# Altium schematic sheet 18 USB3_ports.SchDoc
size 420 x 297 mm
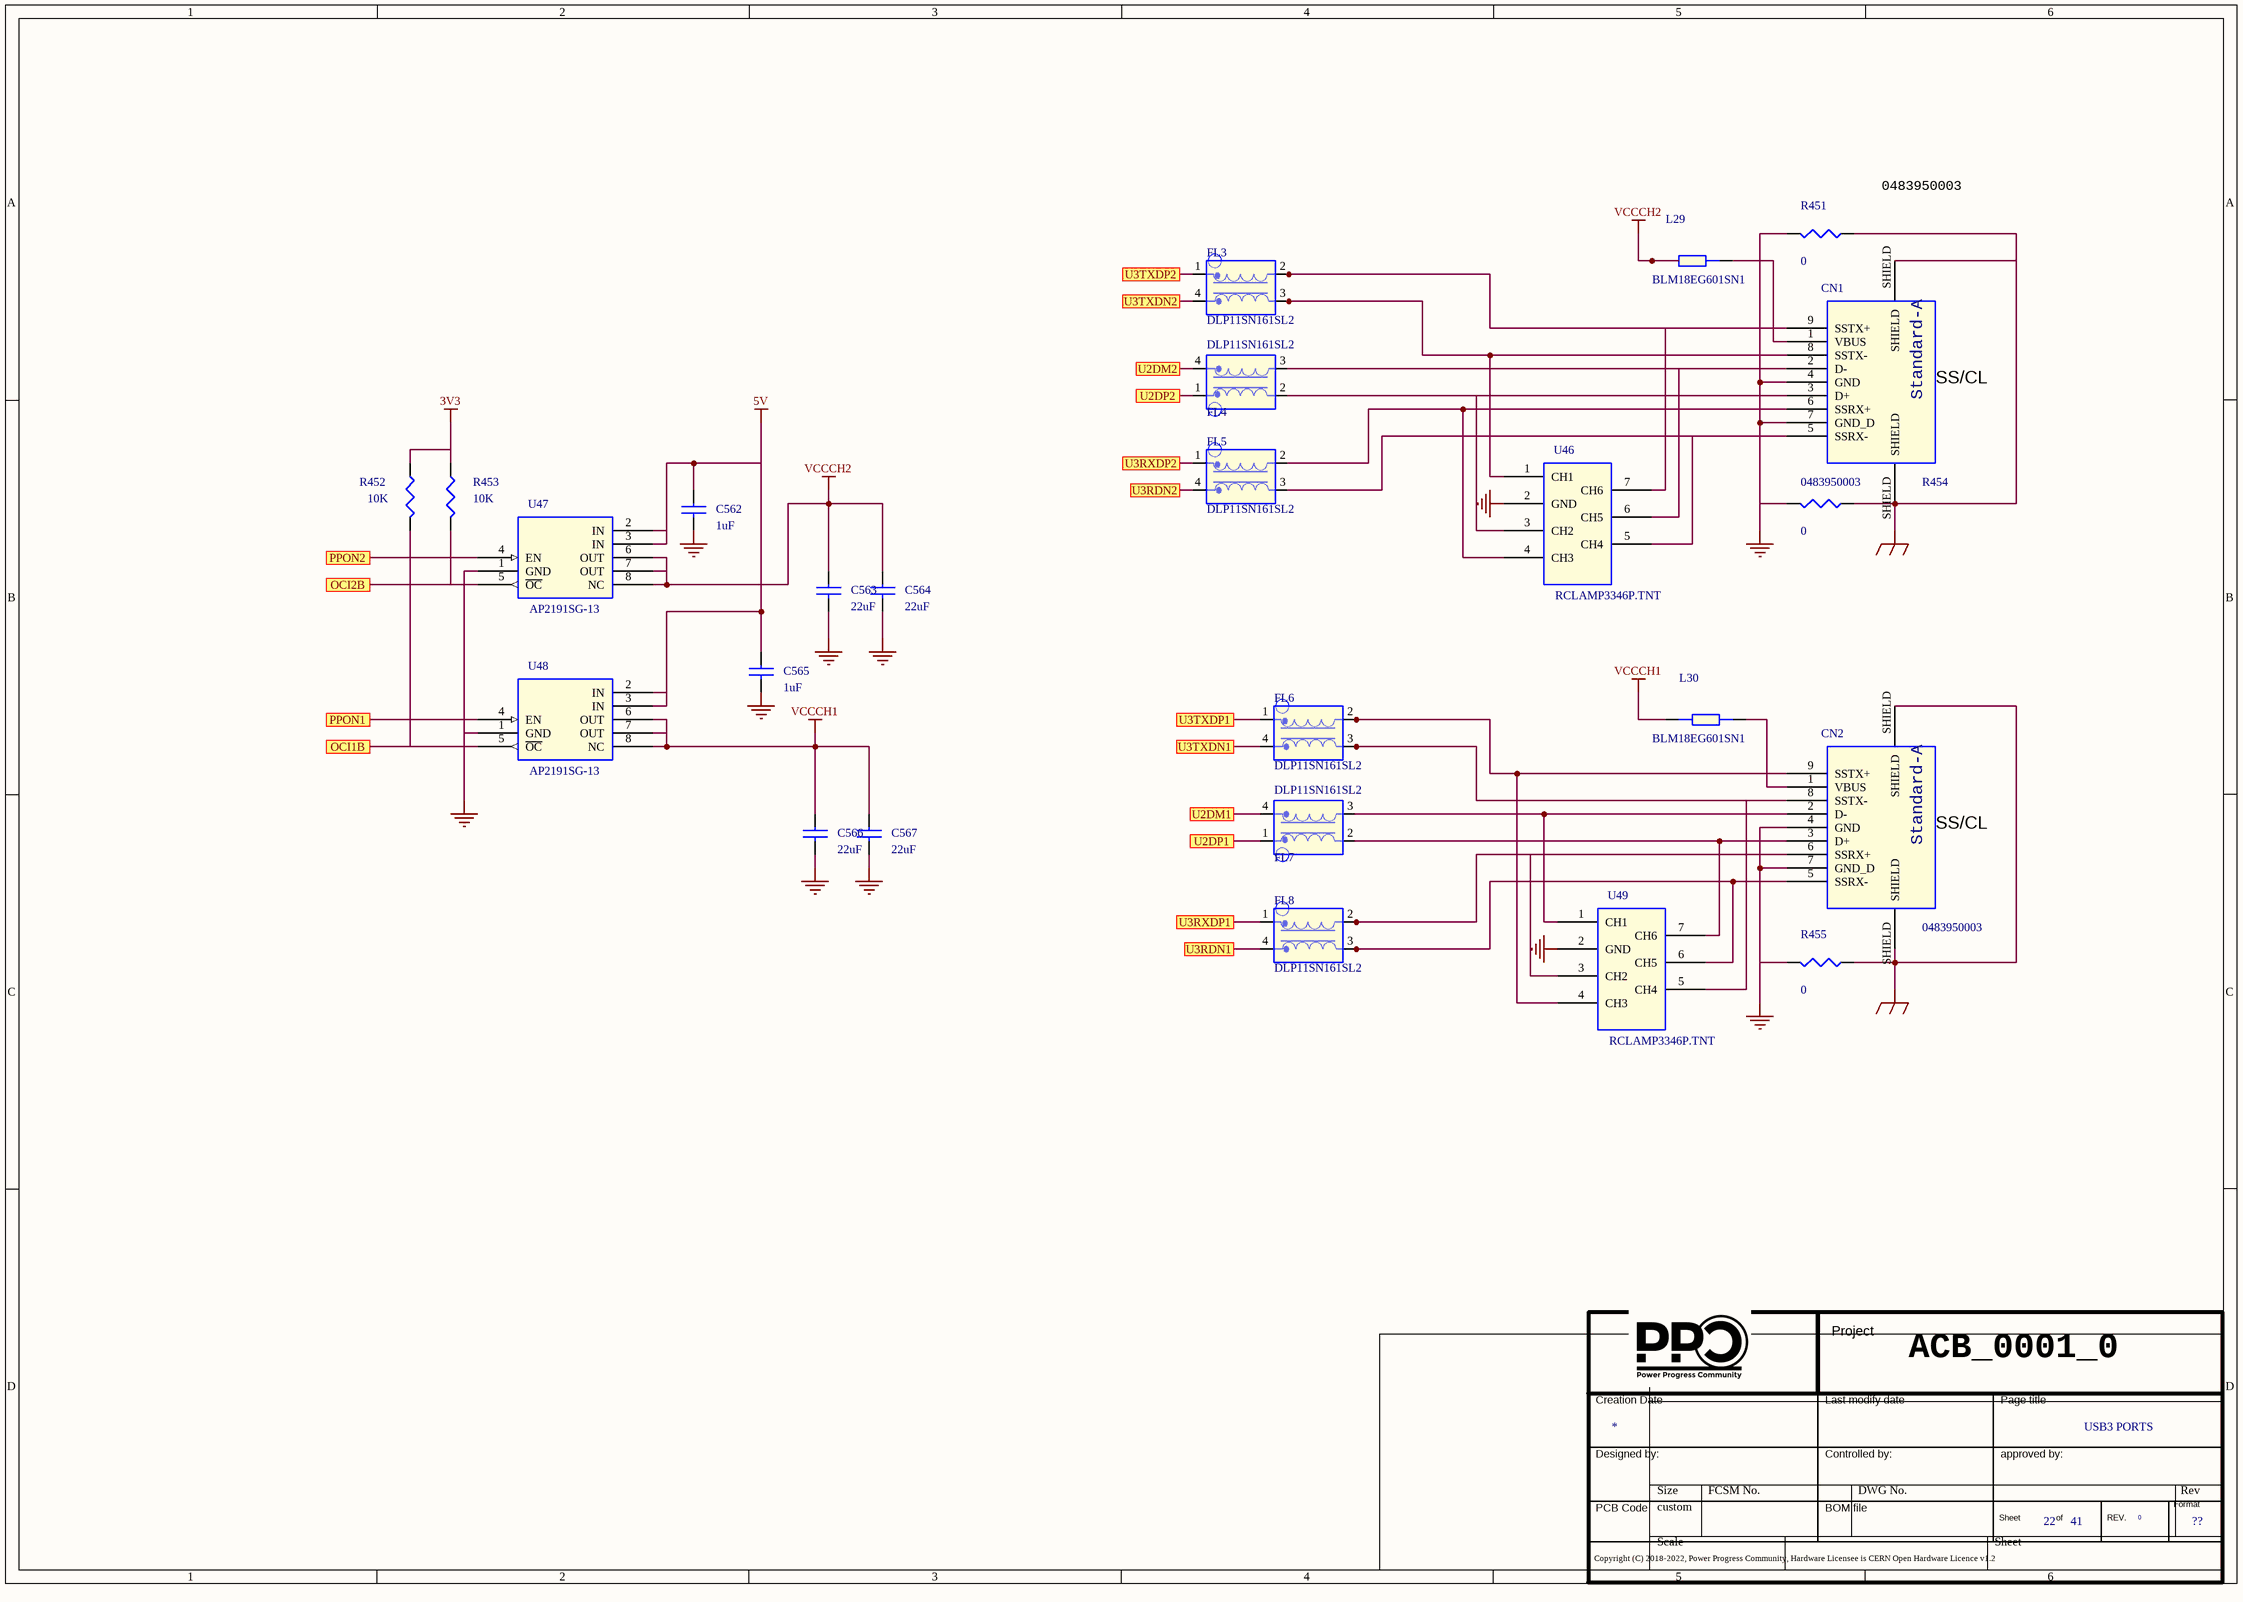
[diagram p0: 18 USB3_ports.SchDoc]

## Parts
*  Doc: USB3 PORTS  Page Count: 41  Page Number: 22  Page Size: ??  RevCode: 0  (hidden comment: Title_block_PPC)  (graphical)
C562  1uF  [SMD_0402]
C563  22uF  [SMD_0805]
C564  22uF  [SMD_0805]
C565  1uF  [SMD_0402]
C566  22uF  [SMD_0805]
C567  22uF  [SMD_0805]
CN1  0483950003  [9 PIN PTH]
CN2  0483950003  [9 PIN PTH]
FL3  DLP11SN161SL2  [SMD]
FL4  DLP11SN161SL2  [SMD]
FL5  DLP11SN161SL2  [SMD]
FL6  DLP11SN161SL2  [SMD]
FL7  DLP11SN161SL2  [SMD]
FL8  DLP11SN161SL2  [SMD]
L29  BLM18EG601SN1  [SMD_0603]
L30  BLM18EG601SN1  [SMD_0603]
R451  0  [SMD_0402]
R452  10K  [SMD_0402]
R453  10K  [SMD_0402]
R454  0  [SMD_0402]
R455  0  [SMD_0402]
U46  RCLAMP3346P.TNT  [ 7-UDFN]
U47  AP2191SG-13  [SOIC8]
U48  AP2191SG-13  [SOIC8]
U49  RCLAMP3346P.TNT  [ 7-UDFN]

## Ports
OCI1B, OCI2B, PPON1, PPON2, U2DM1, U2DM2, U2DP1, U2DP2, U3RDN1, U3RDN2, U3RXDP1, U3RXDP2, U3TXDN1, U3TXDN2, U3TXDP1, U3TXDP2

## Nets
3V3: R452.2 R453.2
5V: C562.1 C565.1 U47.2(IN) U47.3(IN) U48.2(IN) U48.3(IN)
GND: C562.2 C563.2 C564.2 C565.2 C566.2 C567.2 CN1.4(GND) CN1.7(GND_D) CN2.4(GND) CN2.7(GND_D) R451.1 R454.1 R455.1 U46.2(GND) U47.1(GND) U48.1(GND) U49.2(GND)
GND_EARTH: CN1.SHIELD CN2.SHIELD R451.2 R454.2 R455.2
VCCCH1: C566.1 C567.1 L30.1 U48.6(OUT) U48.7(OUT) U48.8(NC)
VCCCH2: C563.1 C564.1 L29.1 U47.6(OUT) U47.7(OUT) U47.8(NC)
OCI1B: R452.1 U48.5(~{OC}) ; port OCI1B
OCI2B: R453.1 U47.5(~{OC}) ; port OCI2B
PPON1: U48.4(EN) ; port PPON1
PPON2: U47.4(EN) ; port PPON2
U2DM1: FL7.4 ; port U2DM1
U2DM2: FL4.4 ; port U2DM2
U2DP1: FL7.1 ; port U2DP1
U2DP2: FL4.1 ; port U2DP2
U3RDN1: FL8.4 ; port U3RDN1
U3RDN2: FL5.4 ; port U3RDN2
U3RXDP1: FL8.1 ; port U3RXDP1
U3RXDP2: FL5.1 ; port U3RXDP2
U3TXDN1: FL6.4 ; port U3TXDN1
U3TXDN2: FL3.4 ; port U3TXDN2
U3TXDP1: FL6.1 ; port U3TXDP1
U3TXDP2: FL3.1 ; port U3TXDP2
NetCN1_1: CN1.1(VBUS) L29.2
NetCN1_2: CN1.2(D-) FL4.3 U46.6(CH5)
NetCN1_3: CN1.3(D+) FL4.2 U46.3(CH2)
NetCN1_5: CN1.5(SSRX-) FL5.3 U46.5(CH4)
NetCN1_6: CN1.6(SSRX+) FL5.2 U46.4(CH3)
NetCN1_8: CN1.8(SSTX-) FL3.3 U46.1(CH1)
NetCN1_9: CN1.9(SSTX+) FL3.2 U46.7(CH6)
NetCN2_1: CN2.1(VBUS) L30.2
NetCN2_2: CN2.2(D-) FL7.3 U49.1(CH1)
NetCN2_3: CN2.3(D+) FL7.2 U49.7(CH6)
NetCN2_5: CN2.5(SSRX-) FL8.3 U49.6(CH5)
NetCN2_6: CN2.6(SSRX+) FL8.2 U49.3(CH2)
NetCN2_8: CN2.8(SSTX-) FL6.3 U49.5(CH4)
NetCN2_9: CN2.9(SSTX+) FL6.2 U49.4(CH3)

## Notes on the sheet
- 0483950003
- (near CN1) SS/CL
- (near CN2) SS/CL
- ACB_0001_0
- (in symbol Title_block_PPC) Project; Creation Date; Last modify date; Page title; Designed by:; Controlled by:; approved by:; Format; PCB Code; BOM file; Sheet; of; REV.; Copyright (C) 2018-2022, Power Progress Community, Hardware Licensee is CERN Open Hardware Licence v1.2
- (in symbol USB3-StdA-R_1) Standard-A

## Library data of the parts
* = Title_block_PPC: Title: T2080PCIe; Author: MICETEK; Page Create Date: March  8, 1995; Page Title: ?; Page Modify Date: *
C562 C565 = CAP NP_Dup3: CAP CER 1UF 25V X6S 0402; Manufacturer Part Number 1: GRM155C81E105KE11D; Manufacturer 1: Murata; Part Number: PASSIVE_1446; RSM: RC0402; PCB Footprint: SMD_0402; Part Type: Capacitors\Ceramic\SMD\0402
C563 C564 C566 C567 = CAP NP_Dup3: 22UF 35V 20% 0805; Manufacturer Part Number 1: C2012X5R1V226M125AC; Manufacturer 1: TDK; Part Number: PASSIVE_224; RSM: RC0805; PCB Footprint: SMD_0805; Part Type: Capacitors\Ceramic\SMD\0805
CN1 CN2 = USB3-StdA-R_1: CONN RCP USB3.0 TYPEA 9POS TH RA MID mount; Part Number: CONNECTORS_702; Manufacturer 1: molex; RSM: MOLEX-USB-483950003; Part Type: USB\USB30; Manufacturer Part Number 1: 0483950003; Distributor 1: DIGIKEY(WM10415TR-ND); PCB Footprint: 9 PIN PTH
FL3 FL4 FL7 = USB_CHOKE: CHOKE COMMON MODE 90 OHM 0805; Manufacturer Part Number 1: DLW21HN900SQ2L; Manufacturer 1: Murata; Part Number: PASSIVE_1366; RSM: EMI-DLW21; PCB Footprint: SMD; Distributor 1: DIGIKEY(490-1064-1-ND); Part Type: FILTER
FL5 FL6 FL8 = USB_CHOKE: CHOKE COMMON MODE 90 OHM 0805; Part Number: PASSIVE_1366; Manufacturer 1: Murata; Manufacturer Part Number 1: DLW21HN900SQ2L; RSM: EMI-DLW21; Part Type: FILTER; Distributor 1: DIGIKEY(490-1064-1-ND); PCB Footprint: SMD
L29 = FERRITE_BEAD: FERRITE BEAD 600ohm 500mA 0603 SMD; Manufacturer Part Number 1: BLM18EG601SN1 SMD; Manufacturer 1: Murata; Part Number: PASSIVE_377; RSM: RC0603; PCB Footprint: SMD_0603; Part Type: Ferrite Beads\SMD\0603
L30 = FERRITE_BEAD: FERRITE BEAD 600ohm 500mA 0603 SMD; Part Number: PASSIVE_377; Manufacturer 1: Murata; Manufacturer Part Number 1: BLM18EG601SN1 SMD; RSM: RC0603; Part Type: Ferrite Beads\SMD\0603; PCB Footprint: SMD_0603
R451 R455 = R_Dup6: RESIS.CHIP 0R 5% 0402 SMD; Part Number: PASSIVE_805; Manufacturer 1: ROYAL OHM; RSM: RC0402; Part Type: Resistors\Fixed\SMD\0402\5%; PCB Footprint: SMD_0402; Manufacturer Part Number 1: RESIS.CHIP 0R 5% 0402 SMD
R452 = R_Dup6: RESIS.CHIP 10K 1% 0402 SMD; Part Number: PASSIVE_584; Manufacturer 1: ROYAL OHM; RSM: RC0402; Part Type: Resistors\Fixed\SMD\0402\1%; Manufacturer Part Number 1: RESIS.CHIP 10K 1% 0402 SMD; PCB Footprint: SMD_0402
R453 = R_Dup6: RESIS.CHIP 10K 1% 0402 SMD; Manufacturer 1: ROYAL OHM; Part Number: PASSIVE_584; RSM: RC0402; Manufacturer Part Number 1: RESIS.CHIP 10K 1% 0402 SMD; PCB Footprint: SMD_0402; Part Type: Resistors\Fixed\SMD\0402\1%
R454 = R_Dup6: RESIS.CHIP 0R 5% 0402 SMD; Manufacturer 1: ROYAL OHM; Part Number: PASSIVE_805; RSM: RC0402; PCB Footprint: SMD_0402; Manufacturer Part Number 1: RESIS.CHIP 0R 5% 0402 SMD; Part Type: Resistors\Fixed\SMD\0402\5%
U46 U49 = PUSB3AB6: High speed ESD protection LOW CAPACITANCE; Part Number: DISCRETE_290; Manufacturer 1: Semtech; PCB Footprint: 7-UDFN; Part Type: Protections; Manufacturer Part Number 1: RCLAMP3346P.TNT; Distributor 1: DIGIKEY(RCLAMP3346P.TNTCT-ND); RSM: RCLAMP3346P
U47 U48 = RT9715CGBR_2: usb distribuzione alimentazione 1.5A 2.7V-5.5V; Part Number: LOGIC_353; Manufacturer 1: DIODES; RSM: SO-8; Part Type: USB\SWITCH; Manufacturer Part Number 1: AP2191SG-13; Distributor 1: MOUSER(621-AP2191SG-13); PCB Footprint: SOIC8